# Altium schematic sheet Main.SchDoc
size A4
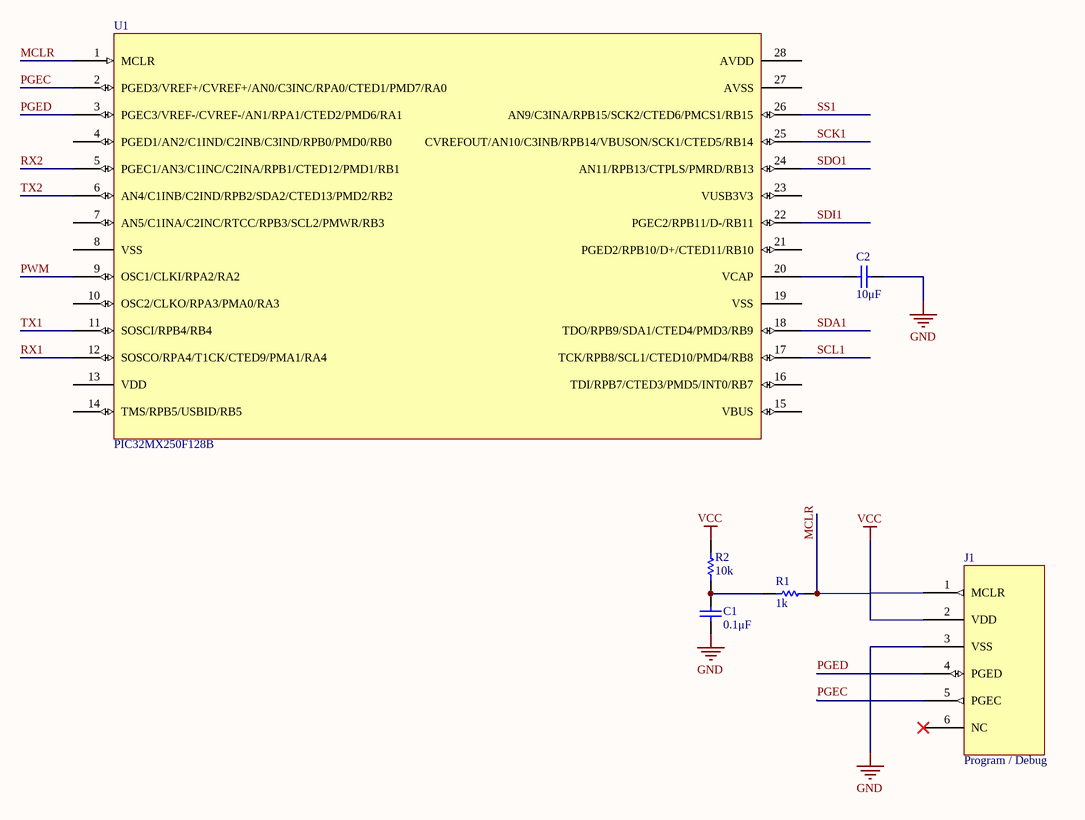
[diagram p0: Main.SchDoc]

## Parts
C1  0.1μF  [RAD-0.3]
C2  10μF  [RAD-0.3]
J1  Program / Debug  [C-Grid III X6]
R1  1k  [AXIAL-0.3]
R2  10k  [AXIAL-0.3]
U1  PIC32MX250F128B

## Nets
GND: C1.1 C2.1 J1.3(VSS)
VCC: J1.2(VDD) R2.1
MCLR: J1.1(MCLR) R1.1 U1.1(MCLR)
PGEC: J1.5(PGEC) U1.2(PGED3/VREF+/CVREF+/AN0/C3INC/RPA0/CTED1/PMD7/RA0)
PGED: J1.4(PGED) U1.3(PGEC3/VREF-/CVREF-/AN1/RPA1/CTED2/PMD6/RA1)
PWM: U1.9(OSC1/CLKI/RPA2/RA2)
RX1: U1.12(SOSCO/RPA4/T1CK/CTED9/PMA1/RA4)
RX2: U1.5(PGEC1/AN3/C1INC/C2INA/RPB1/CTED12/PMD1/RB1)
SCK1: U1.25(CVREFOUT/AN10/C3INB/RPB14/VBUSON/SCK1/CTED5/RB14)
SCL1: U1.17(TCK/RPB8/SCL1/CTED10/PMD4/RB8)
SDA1: U1.18(TDO/RPB9/SDA1/CTED4/PMD3/RB9)
SDI1: U1.22(PGEC2/RPB11/D-/RB11)
SDO1: U1.24(AN11/RPB13/CTPLS/PMRD/RB13)
SS1: U1.26(AN9/C3INA/RPB15/SCK2/CTED6/PMCS1/RB15)
TX1: U1.11(SOSCI/RPB4/RB4)
TX2: U1.6(AN4/C1INB/C2IND/RPB2/SDA2/CTED13/PMD2/RB2)
NetC1_2: C1.2 R1.2 R2.2
NetC2_2: C2.2 U1.20(VCAP)

Not connected (* = marked no-connect by the designer): J1 6(NC)*; U1 4(PGED1/AN2/C1IND/C2INB/C3IND/RPB0/PMD0/RB0) 7(AN5/C1INA/C2INC/RTCC/RPB3/SCL2/PMWR/RB3) 8(VSS) 10(OSC2/CLKO/RPA3/PMA0/RA3) 13(VDD) 14(TMS/RPB5/USBID/RB5) 15(VBUS) 16(TDI/RPB7/CTED3/PMD5/INT0/RB7) 19(VSS) 21(PGED2/RPB10/D+/CTED11/RB10) 23(VUSB3V3) 27(AVSS) 28(AVDD)

## Library data of the parts
C1 C2 = Cap: Capacitor; Published: 8-Jun-2000; LatestRevisionDate: 17-Jul-2002; LatestRevisionNote: Re-released for DXP Platform.; PackageReference: RAD-0.3; Publisher: Altium Limited; PackageDescription: Radial Cap, Thru-Hole; 2 Leads; 0.3 in Pin Spacing
  C1: Value: 0.1μF
  C2: Value: 10μF
J1 = ICSP: Fabricant: Molex; RefFabricant: 90120-0126; Fournisseur: Farnell; RefFournisseur: 2313717
R1 R2 = Res1: Resistor; Published: 8-Jun-2000; LatestRevisionDate: 17-Jul-2002; LatestRevisionNote: Re-released for DXP Platform.; PackageReference: AXIAL-0.3; Publisher: Altium Limited; PackageDescription: Axial Device, Thru-Hole; 2 Leads; 0.3 in Pin Spacing
  R1: Value: 1k
  R2: Value: 10k
U1 = PIC32MX250F128B: Microcontrolleur; Fabricant: Microchip; RefFabricant: PIC32MX250F128B-I/SO; Fournisseur: Farnell; RefFournisseur: 2097772